# EAGLE design Arduino_MEGA_2560-Rev3 (EAGLE 7.6.0)
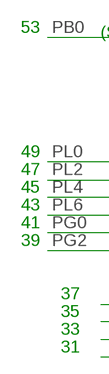
[diagram p0: schematic, sheet 1, part 1 of 2]
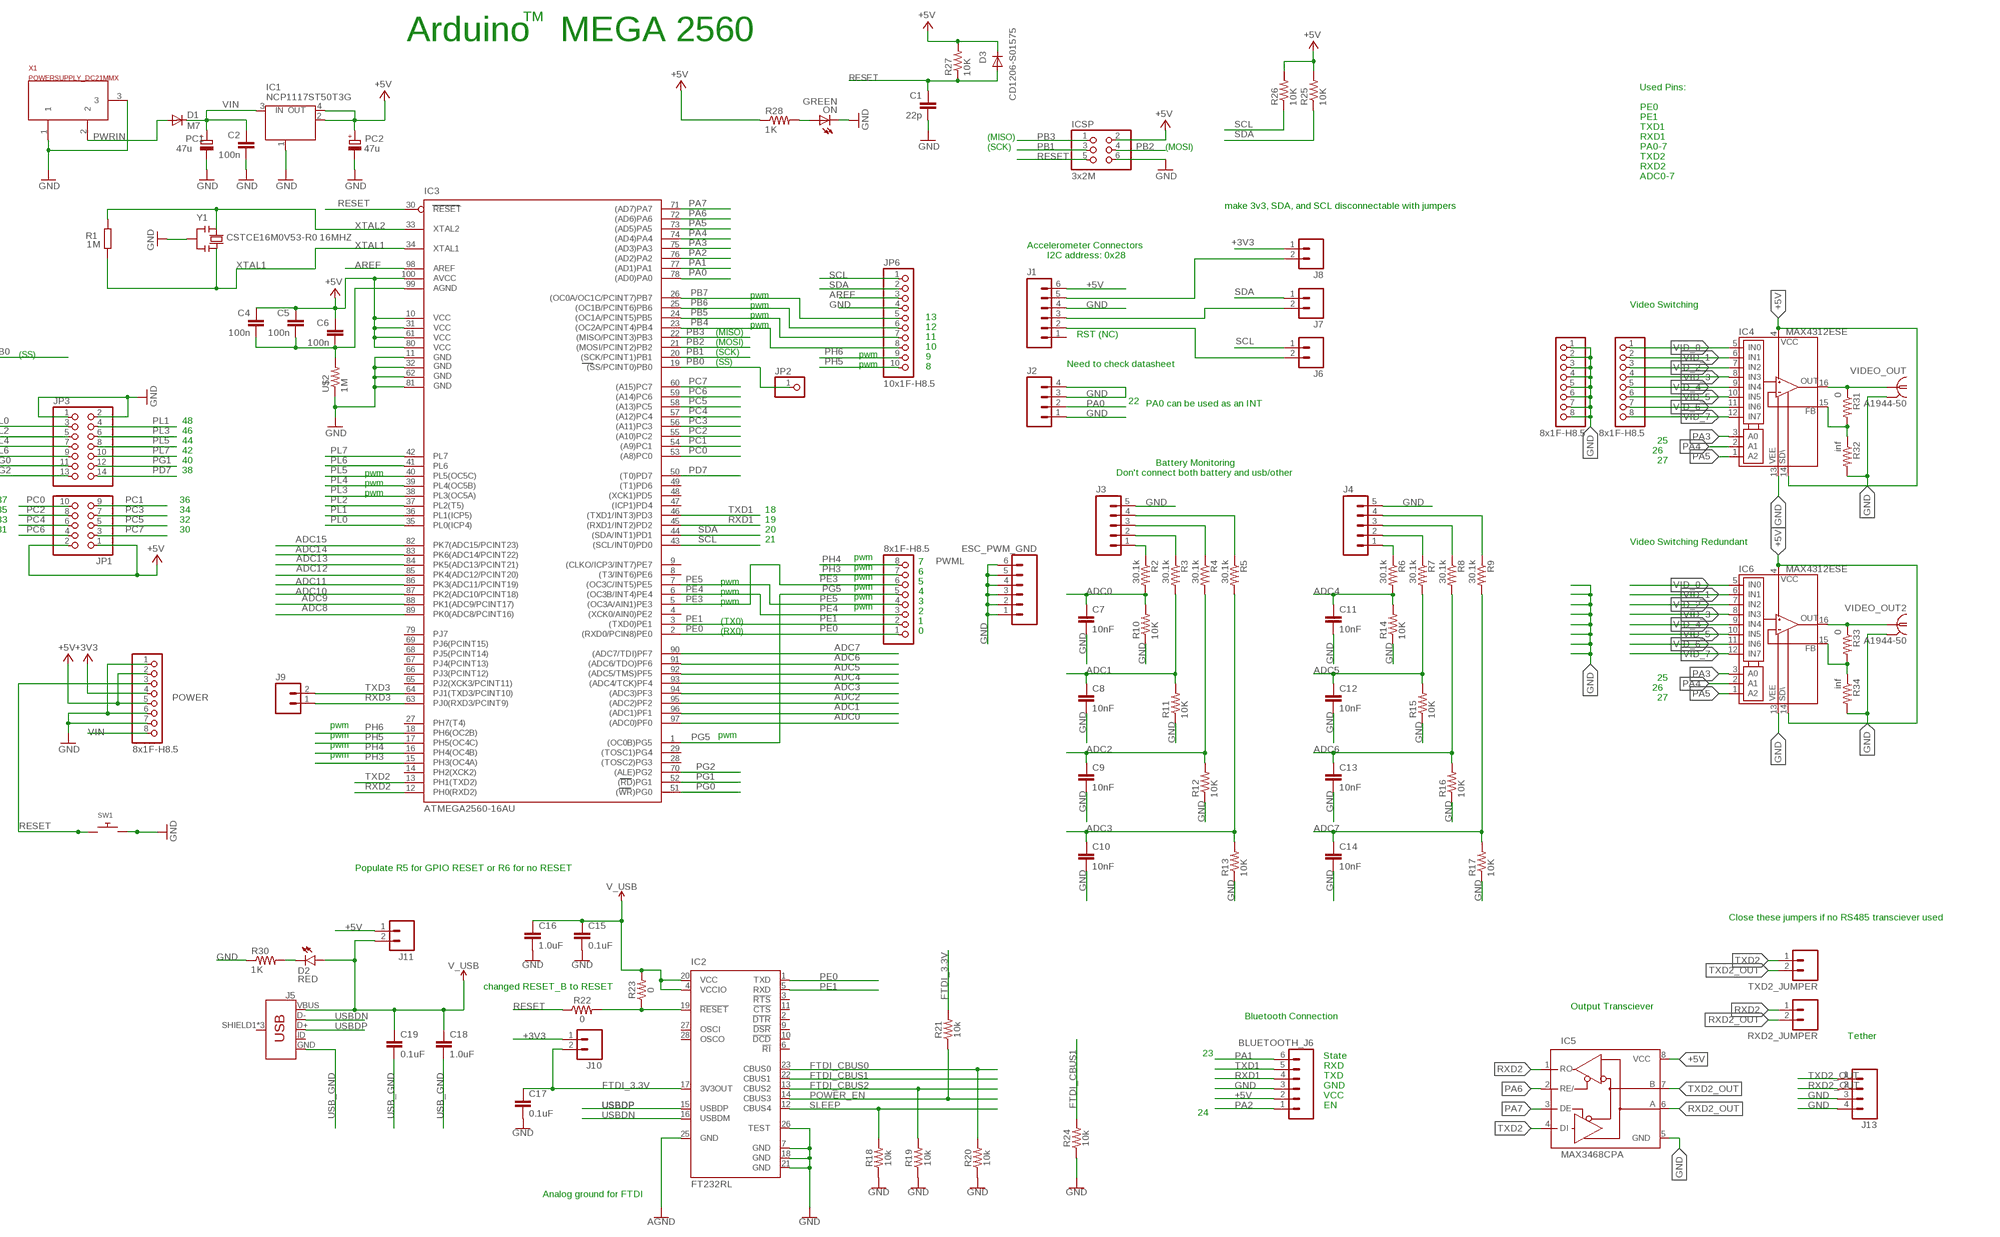
[diagram p1: schematic, sheet 1, part 2 of 2]

## Parts
BLUETOOTH_J6  M06LONGPADS  [1X06_LONGPADS]
C1  22p  C-EU0603-RND  [C0603-ROUND]
C2  100n  C-EU0603-RND  [C0603-ROUND]
C4  100n  C-EU0603-RND  [C0603-ROUND]
C5  100n  C-EU0603-RND  [C0603-ROUND]
C6  100n  C-EU0603-RND  [C0603-ROUND]
C7  10nF  10NF/10000PF-50V-10%(0603)  [0603-CAP]
C8  10nF  10NF/10000PF-50V-10%(0603)  [0603-CAP]
C9  10nF  10NF/10000PF-50V-10%(0603)  [0603-CAP]
C10  10nF  10NF/10000PF-50V-10%(0603)  [0603-CAP]
C11  10nF  10NF/10000PF-50V-10%(0603)  [0603-CAP]
C12  10nF  10NF/10000PF-50V-10%(0603)  [0603-CAP]
C13  10nF  10NF/10000PF-50V-10%(0603)  [0603-CAP]
C14  10nF  10NF/10000PF-50V-10%(0603)  [0603-CAP]
C15  0.1uF  0.1UF-0603-25V-5%  [0603]
C16  1.0uF  1.0UF-0603-16V-10%  [0603]
C17  0.1uF  0.1UF-0603-25V-5%  [0603]
C18  1.0uF  1.0UF-0603-16V-10%  [0603]
C19  0.1uF  0.1UF-0603-25V-5%  [0603]
D1  M7  DIODE-SMB  [SMB]
D2  RED  LED-RED0603  [LED-0603]
D3  CD1206-S01575  DIODE-MINIMELF  [MINIMELF]
ESC_PWM_GND  M06LONGPADS  [1X06_LONGPADS]
IC1  NCP1117ST50T3G  MC33269ST-3.3T3  [SOT223]
IC2  FT232RL  [SSOP28]
IC3  ATMEGA2560-16AU  ATMEGA25602560-16AU  [TQFP100]
IC4  MAX4312ESE  [SO16]
IC5  MAX3468CPA  [DIL08]
IC6  MAX4312ESE  [SO16]
ICSP  3x2M  PINHD-2X3  [2X03]
J1  M06LONGPADS  [1X06_LONGPADS]
J2  M04LONGPADS  [1X04_LONGPADS]
J3  M05JST-VERT  [JST-5-PTH-VERT]
J4  M05JST-VERT  [JST-5-PTH-VERT]
J5  USB_MICRO-B_FEMALE-SMT  [USB-B-MICRO-SMD]
J6  M02PTH  [1X02]
J7  M02PTH  [1X02]
J8  M02PTH  [1X02]
J9  M02PTH  [1X02]
J10  M02PTH  [1X02]
J11  M02PTH  [1X02]
J13  M04LONGPADS  [1X04_LONGPADS]
JP1  PINHD-2X5  [2X05]
JP2  PINHD-1X1  [1X01]
JP3  PINHD-2X7  [2X07]
JP6  10x1F-H8.5  PINHD-1X10_ARD  [1X10]
ON  GREEN  LEDCHIP-LED0805  [CHIP-LED0805]
PC1  47u  CPOL-EUD  [PANASONIC_D]
PC2  47u  CPOL-EUD  [PANASONIC_D]
POWER  8x1F-H8.5  PINHD-1X8  [1X08]
PWML  8x1F-H8.5  PINHD-1X8  [1X08]
R1  1M  R-EU_R0603  [R0603-ROUND]
R2  30.1k  30.1KOHM1/10W1%(0603)  [0603-RES]
R3  30.1k  30.1KOHM1/10W1%(0603)  [0603-RES]
R4  30.1k  30.1KOHM1/10W1%(0603)  [0603-RES]
R5  30.1k  30.1KOHM1/10W1%(0603)  [0603-RES]
R6  30.1k  30.1KOHM1/10W1%(0603)  [0603-RES]
R7  30.1k  30.1KOHM1/10W1%(0603)  [0603-RES]
R8  30.1k  30.1KOHM1/10W1%(0603)  [0603-RES]
R9  30.1k  30.1KOHM1/10W1%(0603)  [0603-RES]
R10  10K  10KOHM-1/10W-1%(0603)0603  [0603-RES]
R11  10K  10KOHM-1/10W-1%(0603)0603  [0603-RES]
R12  10K  10KOHM-1/10W-1%(0603)0603  [0603-RES]
R13  10K  10KOHM-1/10W-1%(0603)0603  [0603-RES]
R14  10K  10KOHM-1/10W-1%(0603)0603  [0603-RES]
R15  10K  10KOHM-1/10W-1%(0603)0603  [0603-RES]
R16  10K  10KOHM-1/10W-1%(0603)0603  [0603-RES]
R17  10K  10KOHM-1/10W-1%(0603)0603  [0603-RES]
R18  10k  10KOHM-0603-1/10W-1%  [0603]
R19  10k  10KOHM-0603-1/10W-1%  [0603]
R20  10k  10KOHM-0603-1/10W-1%  [0603]
R21  10k  10KOHM-0603-1/10W-1%  [0603]
R22  0  0OHM-0603-1/10W-5%  [0603]
R23  0  0OHM-0603-1/10W-5%  [0603]
R24  10k  10KOHM-0603-1/10W-1%  [0603]
R25  10K  10KOHM-1/10W-1%(0603)0603  [0603-RES]
R26  10K  10KOHM-1/10W-1%(0603)0603  [0603-RES]
R27  10K  10KOHM-1/10W-1%(0603)0603  [0603-RES]
R28  1K  1KOHM-1/10W-1%(0603)  [0603-RES]
R30  1K  1KOHM-1/10W-1%(0603)  [0603-RES]
R31  0  30.1KOHM1/10W1%(0603)  [0603-RES]
R32  inf  30.1KOHM1/10W1%(0603)  [0603-RES]
R33  0  30.1KOHM1/10W1%(0603)  [0603-RES]
R34  inf  30.1KOHM1/10W1%(0603)  [0603-RES]
RXD2_JUMPER  M02PTH  [1X02]
SW1  SWITCH_PUSHBUTTONC&K_KSS  [BTN_CK_KSS]
TXD2_JUMPER  M02PTH  [1X02]
U$2  1M  820KOHM-1/10W-1%(0603)  [0603-RES]
VIDEO_IN  8x1F-H8.5  PINHD-1X8  [1X08]
VIDEO_IN_GND  8x1F-H8.5  PINHD-1X8  [1X08]
VIDEO_OUT  A1944-50  [A1944]
VIDEO_OUT2  A1944-50  [A1944]
X1  POWERSUPPLY_DC21MMX  [POWERSUPPLY_DC-21MM]
Y1  CSTCE16M0V53-R0 16MHZ  RESONATORMU  [RESONATOR]

## Nets
+3V3 [power]: J8.1 J10.1 POWER.4
+5V [power usb]: BLUETOOTH_J6.2 C4.1 C5.1 C6.1 D3.C IC1.2(OUT) IC1.4(OUT) IC3.10(VCC) IC3.31(VCC1) IC3.61(VCC2) IC3.80(VCC3) IC3.100(AVCC) IC4.4(V+) IC4.14(!SHDN) IC5.8(VCC) IC6.4(V+) IC6.14(!SHDN) ICSP.2 J1.6 J11.1 JP1.1 JP1.2 PC2.+ POWER.2 POWER.5 R25.2 R26.2 R27.2 R28.1
ADC0: C7.1 IC3.97((ADC0)PF0) R2.2 R10.2
ADC1: C8.1 IC3.96((ADC1)PF1) R3.2 R11.2
ADC2: C9.1 IC3.95((ADC2)PF2) R4.2 R12.2
ADC3: C10.1 IC3.94((ADC3)PF3) R5.2 R13.2
ADC4: C11.1 IC3.93((ADC4/TCK)PF4) R6.2 R14.2
ADC5: C12.1 IC3.92((ADC5/TMS)PF5) R7.2 R15.2
ADC6: C13.1 IC3.91((ADC6/TDO)PF6) R8.2 R16.2
ADC7: C14.1 IC3.90((ADC7/TDI)PF7) R9.2 R17.2
ADC8: IC3.89(PK0(ADC8/PCINT16))
ADC9: IC3.88(PK1(ADC9/PCINT17))
ADC10: IC3.87(PK2(ADC10/PCINT18))
ADC11: IC3.86(PK3(ADC11/PCINT19))
ADC12: IC3.85(PK4(ADC12/PCINT20))
ADC13: IC3.84(PK5(ADC13/PCINT21))
ADC14: IC3.83(PK6(ADC14/PCINT22))
ADC15: IC3.82(PK7(ADC15/PCINT23))
AGND: C4.2 C5.2 C6.2 IC2.25(GND) IC3.99(AGND) U$2.2
AREF: IC3.98(AREF) JP6.3
FTDI_3.3V: C17.1 IC2.17(3V3OUT) J10.2 R21.2
FTDI_CBUS0: IC2.23(CBUS0) R20.2
FTDI_CBUS1: IC2.22(CBUS1) R24.2
FTDI_CBUS2: IC2.13(CBUS2) R19.2
GND [gnd]: BLUETOOTH_J6.3 C1.2 C2.2 C7.2 C8.2 C9.2 C10.2 C11.2 C12.2 C13.2 C14.2 C15.2 C16.2 C17.2 ESC_PWM_GND.1 ESC_PWM_GND.2 ESC_PWM_GND.3 ESC_PWM_GND.4 ESC_PWM_GND.5 ESC_PWM_GND.6 IC1.1(GND/ADJ) IC2.7(GND) IC2.18(GND) IC2.21(GND) IC2.26(TEST) IC3.11(GND) IC3.32(GND1) IC3.62(GND2) IC3.81(GND3) IC4.13(V-) IC5.5(GND) IC6.13(V-) ICSP.6 J1.4 J2.1 J2.3 J2.4 J3.5 J4.5 J13.3 J13.4 JP3.1 JP3.2 JP6.4 ON.C PC1.- PC2.- POWER.1 POWER.6 POWER.7 R10.1 R11.1 R12.1 R13.1 R14.1 R15.1 R16.1 R17.1 R18.1 R19.1 R20.1 R24.1 R30.1 R32.2 R34.2 SW1.P$2 U$2.1 VIDEO_IN_GND.1 VIDEO_IN_GND.2 VIDEO_IN_GND.3 VIDEO_IN_GND.4 VIDEO_IN_GND.5 VIDEO_IN_GND.6 VIDEO_IN_GND.7 VIDEO_IN_GND.8 VIDEO_OUT2.2 VIDEO_OUT2.3 VIDEO_OUT2.4 VIDEO_OUT2.5 VIDEO_OUT.2 VIDEO_OUT.3 VIDEO_OUT.4 VIDEO_OUT.5 X1.1 X1.3 Y1.2
N$1: J3.1 R2.1
N$3: ON.A R28.2
N$4: IC2.19(!RESET) R22.2 R23.1
N$5: J4.1 R6.1
N$6: J3.2 R3.1
N$7: J1.5 J8.2
N$8: J3.3 R4.1
N$9: J1.3 J7.2
N$10: J3.4 R5.1
N$11: J1.2 J6.2
N$12: J4.2 R7.1
N$13: J4.3 R8.1
N$14: J4.4 R9.1
N$15: D2.C R30.2
N$17: IC4.15(FB) R31.2 R32.1
N$18: IC6.15(FB) R33.2 R34.1
PA0: IC3.78((AD0)PA0) J2.2
PA1: BLUETOOTH_J6.6 IC3.77((AD1)PA1)
PA2: BLUETOOTH_J6.1 IC3.76((AD2)PA2)
PA3: IC3.75((AD3)PA3) IC4.3(A0) IC6.3(A0)
PA4: IC3.74((AD4)PA4) IC4.2(A1) IC6.2(A1)
PA5: IC3.73((AD5)PA5) IC4.1(A2) IC6.1(A2)
PA6: IC3.72((AD6)PA6) IC5.2(RE/)
PA7: IC3.71((AD7)PA7) IC5.3(DE)
PB0: IC3.19((SS/PCINT0)PB0) JP2.1
PB1: IC3.20((SCK/PCINT1)PB1) ICSP.3
PB2: IC3.21((MOSI/PCINT2)PB2) ICSP.4
PB3: IC3.22((MISO/PCINT3)PB3) ICSP.1
PB4: IC3.23((OC2A/PCINT4)PB4) JP6.8
PB5: IC3.24((OC1A/PCINT5)PB5) JP6.7
PB6: IC3.25((OC1B/PCINT6)PB6) JP6.6
PB7: IC3.26((OC0A/OC1C/PCINT7)PB7) JP6.5
PC0: IC3.53((A8)PC0) JP1.10
PC1: IC3.54((A9)PC1) JP1.9
PC2: IC3.55((A10)PC2) JP1.8
PC3: IC3.56((A11)PC3) JP1.7
PC4: IC3.57((A12)PC4) JP1.6
PC5: IC3.58((A13)PC5) JP1.5
PC6: IC3.59((A14)PC6) JP1.4
PC7: IC3.60((A15)PC7) JP1.3
PD7: IC3.50((T0)PD7) JP3.14
PE0: IC2.1(TXD) IC3.2((RXD0/PCIN8)PE0) PWML.1
PE1: IC2.5(RXD) IC3.3((TXD0)PE1) PWML.2
PE3: IC3.5((OC3A/AIN1)PE3) PWML.6
PE4: IC3.6((OC3B/INT4)PE4) PWML.3
PE5: IC3.7((OC3C/INT5)PE5) PWML.4
PG0: IC3.51((WR)PG0) JP3.11
PG1: IC3.52((RD)PG1) JP3.12
PG2: IC3.70((ALE)PG2) JP3.13
PG5: IC3.1((OC0B)PG5) PWML.5
PH3: IC3.15(PH3(OC4A)) PWML.7
PH4: IC3.16(PH4(OC4B)) PWML.8
PH5: IC3.17(PH5(OC4C)) JP6.10
PH6: IC3.18(PH6(OC2B)) JP6.9
PL0: IC3.35(PL0(ICP4)) JP3.3
PL1: IC3.36(PL1(ICP5)) JP3.4
PL2: IC3.37(PL2(T5)) JP3.5
PL3: IC3.38(PL3(OC5A)) JP3.6
PL4: IC3.39(PL4(OC5B)) JP3.7
PL5: IC3.40(PL5(OC5C)) JP3.8
PL6: IC3.41(PL6) JP3.9
PL7: IC3.42(PL7) JP3.10
POWER_EN: IC2.14(CBUS3) R21.1
PWRIN [power]: D1.A X1.2
RESET: C1.1 D3.A IC3.30(RESET) ICSP.5 POWER.3 R22.1 R27.1 SW1.P$1
RXD1: BLUETOOTH_J6.4 IC3.45((RXD1/INT2)PD2)
RXD2: IC3.12(PH0(RXD2)) IC5.1(RO) RXD2_JUMPER.1
RXD2_OUT: IC5.6(A) J13.2 RXD2_JUMPER.2
RXD3: IC3.63(PJ0(RXD3/PCINT9)) J9.1
SCL: IC3.43((SCL/INT0)PD0) J6.1 JP6.1 R26.1
SDA: IC3.44((SDA/INT1)PD1) J7.1 JP6.2 R25.1
SLEEP: IC2.12(CBUS4) R18.2
TXD1: BLUETOOTH_J6.5 IC3.46((TXD1/INT3)PD3)
TXD2: IC3.13(PH1(TXD2)) IC5.4(DI) TXD2_JUMPER.1
TXD2_OUT: IC5.7(B) J13.1 TXD2_JUMPER.2
TXD3: IC3.64(PJ1(TXD3/PCINT10)) J9.2
USB_GND: C18.2 C19.2 J5.GND
USBDN: IC2.16(USBDM) J5.D-
USBDP: IC2.15(USBDP) J5.D+
V_USB: C15.1 C16.1 C18.1 C19.1 D2.A IC2.4(VCCIO) IC2.20(VCC) J5.VBUS J11.2 R23.2
VID_0: IC4.5(IN0) IC6.5(IN0) VIDEO_IN.1
VID_1: IC4.6(IN1) IC6.6(IN1) VIDEO_IN.2
VID_2: IC4.7(IN2) IC6.7(IN2) VIDEO_IN.3
VID_3: IC4.8(IN3) IC6.8(IN3) VIDEO_IN.4
VID_4: IC4.9(IN4) IC6.9(IN4) VIDEO_IN.5
VID_5: IC4.10(IN5) IC6.10(IN5) VIDEO_IN.6
VID_6: IC4.11(IN6) IC6.11(IN6) VIDEO_IN.7
VID_7: IC4.12(IN7) IC6.12(IN7) VIDEO_IN.8
VIDEO_OUT: IC4.16(OUT) R31.1 VIDEO_OUT.1
VIDEO_OUT1: IC6.16(OUT) R33.1 VIDEO_OUT2.1
VIN [power]: C2.1 D1.C IC1.3(IN) PC1.+ POWER.8
XTAL1: IC3.34(XTAL1) R1.1 Y1.3
XTAL2: IC3.33(XTAL2) R1.2 Y1.1
Unconnected: IC2.2(!DTR) IC2.3(!RTS) IC2.6(!RI) IC2.9(!DSR) IC2.10(!DCD) IC2.11(!CTS) IC2.27(OSCI) IC2.28(OSCO) IC3.4((XCK0/AIN0)PE2) IC3.8((T3/INT6)PE6) IC3.9((CLKO/ICP3/INT7)PE7) IC3.14(PH2(XCK2)) IC3.27(PH7(T4)) IC3.28((TOSC2)PG3) IC3.29((TOSC1)PG4) IC3.47((ICP1)PD4) IC3.48((XCK1)PD5) IC3.49((T1)PD6) IC3.65(PJ2(XCK3/PCINT11)) IC3.66(PJ3(PCINT12)) IC3.67(PJ4(PCINT13)) IC3.68(PJ5(PCINT14)) IC3.69(PJ6(PCINT15)) IC3.79(PJ7) J1.1 J5.ID J5.SHIELD1(SHIELD) J5.SHIELD2(SHIELD) J5.SHIELD3(SHIELD)

## Notes on the sheet
- TM
- Arduino   MEGA 2560
- Used Pins:
- PE0
- PE1
- TXD1
- (MISO) | RXD1
- (SCK) | (MOSI) | PA0-7
- TXD2
- RXD2
- ADC0-7
- make 3v3, SDA, and SCL disconnectable with jumpers
- Accelerometer Connectors
- I2C address: 0x28
- pwm
- pwm | Video Switching
- pwm | 13
- pwm | 12
- (MISO) | RST (NC)
- 11
- (MOSI)
- 10
- 53 | (SS) | (SCK) | pwm
- 9
- (SS) | pwm | Need to check datasheet
- 8
- 22 | PA0 can be used as an INT
- 49 | 48
- 47 | 46
- 45 | 44 | 25
- 43 | 42 | 26
- 41 | 40 | Battery Monitoring | 27
- 39 | 38 | pwm | Don't connect both battery and usb/other
- pwm
- pwm
- 37 | 36
- 35 | 34 | 18
- 33 | 32 | 19
- 31 | 30 | 20
- 21 | Video Switching Redundant
- pwm
- 7
- pwm
- 6
- pwm
- pwm | 5
- pwm
- pwm | 4
- pwm
- pwm | 3
- pwm
- 2
- (TX0) | 1
- (RX0) | 0
- 25
- 26
- 27
- pwm
- pwm | pwm
- pwm
- pwm
- Populate R5 for GPIO RESET or R6 for no RESET
- Close these jumpers if no RS485 transciever used
- changed RESET_B to RESET
- Output Transciever
- Bluetooth Connection
- Tether
- 23 | State
- RXD
- TXD
- GND
- VCC
- EN
- 24
- Analog ground for FTDI

## Library data of the parts
BLUETOOTH_J6 ESC_PWM_GND J1 = SparkFun-Connectors:M06: Header 6 Standard 6-pin 0.1" header. Use with straight break away headers (SKU : PRT-00116), right angle break away headers (PRT-00553), swiss pins (PRT-00743), machine pins (PRT-00117), and female headers (PRT-00115). Molex polarized connector foot print use with SKU : PRT-08094 with associated crimp pins and housings. NOTES ON THE VARIANTS LOCK and LOCK_LONGPADS... This footprint was designed to help hold the alignment of a through-hole component (i.e. 6-pin header) while soldering it into place. You may notice that each hole has been shifted either up or down by 0.005 of an inch from it's more standard position (which is a perfectly straight line). This slight alteration caused the pins (the squares in the middle) to touch the edges of the holes. Because they are alternating, it causes a "brace" to hold the component in place. 0.005 has proven to be the perfect amount of "off-center" position when using our standard breakaway headers. Although looks a little odd when you look at the bare footprint, once you have a header in there, the alteration is very hard to notice. Also,if you push a header all the way into place, it is covered up entirely on the bottom side. This idea of altering the position of holes to aid alignment will be further integrated into the Sparkfun Library for other footprints. It can help hold any component with 3 or more connection pins.
C1 C2 C4-C6 = SmartPrj:C-EU: CAPACITOR, European symbol
C7-C14 = SparkFun-Capacitors:10NF/10000PF-50V-10%(0603): CAP-00867; PROD_ID: CAP-00867
C15 C17 C19 = SparkFun-Capacitors:0.1UF: 0.1µF ceramic capacitors A capacitor is a passive two-terminal electrical component used to store electrical energy temporarily in an electric field.; PROD_ID: CAP-08604
C16 C18 = SparkFun-Capacitors:1.0UF: 1µF ceramic capacitors A capacitor is a passive two-terminal electrical component used to store electrical energy temporarily in an electric field.; PROD_ID: CAP-00868
D1 D3 = diode:DIODE-: DIODE
D2 = SparkFun-LED:LED-RED: Assorted Red LEDs LilyPad 1206- DIO-09912 1206- DIO-00809 0603- DIO-00819 "SMART" means more efficient and expensive; PROD_ID: DIO-00819
IC1 = linear:MC33269ST*: Adjustable Output Low Dropout Voltage Regulator 800 mA Source: http://www.onsemi.com/pub/Collateral/MC33269-D.PDF
IC2 = ftdichip:FT232R: Source: http://www.ftdichip.com/Documents/DataSheets/DS_FT232R_v104.pdf; MPN: FT232RL; OC_FARNELL: 1146032; OC_NEWARK: 91K9918
IC3 = SmartPrj:ATMEGA2560: MICROCONTROLLER 64/128/256 Kbytes FLASH 4 Kbytes EEPROM 8 Kbytes SRAM 86 General Purpose I/O pins 12-channels16-bit PWM 4 x Serial USARTs 16-channels 10-bit A/D
IC4 IC6 = maxim:MAX4312: Video Multiplexer-Amplifier High-Speed, Low-Power, Single-Supply, Multichannel; MPN: MAX4312ESE+; OC_FARNELL: unknown; OC_NEWARK: 53K6837
IC5 = maxim:MAX34*: +5V, Fail-Safe, 40Mbps, Profibus RS-485/RS-422 Transceivers Source: MAX3465-MAX3469.pdf; OC_FARNELL: unknown; OC_NEWARK: unknown
ICSP = SmartPrj:PINHD-2X3: PIN HEADER
J2 J13 = SparkFun-Connectors:M04: Header 4 Standard 4-pin 0.1" header. Use with straight break away headers (SKU : PRT-00116), right angle break away headers (PRT-00553), swiss pins (PRT-00743), machine pins (PRT-00117), and female headers (PRT-00115). Molex polarized connector foot print use with SKU : PRT-08231 with associated crimp pins and housings. 1MM SMD Version SKU: PRT-10208; PROD_ID: CONN-09696
J3 J4 = SparkFun-Connectors:M05: Header 5 Standard 5-pin 0.1" header. Use with straight break away headers (SKU : PRT-00116), right angle break away headers (PRT-00553), swiss pins (PRT-00743), machine pins (PRT-00117), and female headers (PRT-00115). Molex polarized connector foot print use with SKU : PRT-08230 with associated crimp pins and housings.
J5 = SparkFun-Connectors:USB_MICRO-B: USB Type Micro-B Connector Male/female and PTH/SMT variants SparkFun Products: SparkFun microB USB Breakout <https://www.sparkfun.com/products/12035> SparkFun USB microB Plug Breakout <https://www.sparkfun.com/products/10031> SparkFun ESP8266 Thing <https://www.sparkfun.com/products/13231>; PROD_ID: CONN-11752
J6-J11 RXD2_JUMPER TXD2_JUMPER = SparkFun-Connectors:M02: Standard 2-pin 0.1" header. Use with - straight break away headers ( PRT-00116) - right angle break away headers (PRT-00553) - swiss pins (PRT-00743) - machine pins (PRT-00117) - female headers (PRT-00115) Molex polarized connector foot print use with: PRT-08233 with associated crimp pins and housings. 2.54_SCREWTERM for use with PRT-10571. 3.5mm Screw Terminal footprints for PRT-08084 5mm Screw Terminal footprints for use with PRT-08432
JP1 = pinhead:PINHD-2X5: PIN HEADER
JP2 = pinhead:PINHD-1X1: PIN HEADER
JP3 = pinhead:PINHD-2X7: PIN HEADER
JP6 = SmartPrj:PINHD-1X10_ARD: PIN HEADER
ON = led:LED: LED OSRAM: - CHIPLED LG R971, LG N971, LY N971, LG Q971, LY Q971, LO R971, LY R971 LH N974, LH R974 LS Q976, LO Q976, LY Q976 LO Q996 - Hyper CHIPLED LW Q18S LB Q993, LB Q99A, LB R99A - SideLED LS A670, LO A670, LY A670, LG A670, LP A670 LB A673, LV A673, LT A673, LW A673 LH A674 LY A675 LS A676, LA A676, LO A676, LY A676, LW A676 LS A679, LY A679, LG A679 - Hyper Micro SIDELED® LS Y876, LA Y876, LO Y876, LY Y876 LT Y87S - SmartLED LW L88C, LW L88S LB L89C, LB L89S, LG L890 LS L89K, LO L89K, LY L89K LS L896, LA L896, LO L896, LY L896 - TOPLED LS T670, LO T670, LY T670, LG T670, LP T670 LSG T670, LSP T670, LSY T670, LOP T670, LYG T670 LG T671, LOG T671, LSG T671 LB T673, LV T673, LT T673, LW T673 LH T674 LS T676, LA T676, LO T676, LY T676, LB T676, LH T676, LSB T676, LW T676 LB T67C, LV T67C, LT T67C, LS T67K, LO T67K, LY T67K, LW E67C LS E67B, LA E67B, LO E67B, LY E67B, LB E67C, LV E67C, LT E67C LW T67C LS T679, LY T679, LG T679 LS T770, LO T770, LY T770, LG T770, LP T770 LB T773, LV T773, LT T773, LW T773 LH T774 LS E675, LA E675, LY E675, LS T675 LS T776, LA T776, LO T776, LY T776, LB T776 LHGB T686 LT T68C, LB T68C - Hyper Mini TOPLED® LB M676 - Mini TOPLED Santana® LG M470 LS M47K, LO M47K, LY M47K Source: http://www.osram.convergy.de LUXEON: - LUMILED® LXK2-PW12-R00, LXK2-PW12-S00, LXK2-PW14-U00, LXK2-PW14-V00 LXK2-PM12-R00, LXK2-PM12-S00, LXK2-PM14-U00 LXK2-PE12-Q00, LXK2-PE12-R00, LXK2-PE12-S00, LXK2-PE14-T00, LXK2-PE14-U00 LXK2-PB12-K00, LXK2-PB12-L00, LXK2-PB12-M00, LXK2-PB14-N00, LXK2-PB14-P00, LXK2-PB14-Q00 LXK2-PR12-L00, LXK2-PR12-M00, LXK2-PR14-Q00, LXK2-PR14-R00 LXK2-PD12-Q00, LXK2-PD12-R00, LXK2-PD12-S00 LXK2-PH12-R00, LXK2-PH12-S00 LXK2-PL12-P00, LXK2-PL12-Q00, LXK2-PL12-R00 Source: www.luxeon.com KINGBRIGHT: KA-3528ASYC Source: www.kingbright.com
PC1 PC2 = rcl:CPOL-EU: POLARIZED CAPACITOR, European symbol
POWER PWML VIDEO_IN VIDEO_IN_GND = SmartPrj:PINHD-1X8: PIN HEADER
R1 = SmartPrj:R-EU_: RESISTOR, European symbol
R2-R9 = SparkFun-Resistors:30.1KOHM1/10W1%(0603): RES-08595; PROD_ID: RES-08595
R10-R17 R25-R27 = SparkFun-Resistors:10KOHM-1/10W-1%(0603): RES-00824; PROD_ID: RES-00824
R18-R21 R24 = SparkFun-Resistors:10KOHM: 10kΩ resistor A resistor is a passive two-terminal electrical component that implements electrical resistance as a circuit element. Resistors act to reduce current flow, and, at the same time, act to lower voltage levels within circuits. - Wikipedia; PROD_ID: RES-00824
R22 R23 = SparkFun-Resistors:0OHM: 0Ω resistor A resistor is a passive two-terminal electrical component that implements electrical resistance as a circuit element. Resistors act to reduce current flow, and, at the same time, act to lower voltage levels within circuits. - Wikipedia; PROD_ID: RES-08609
R28 R30 = SparkFun-Resistors:1KOHM-1/10W-1%(0603): RES-07856; PROD_ID: RES-07856
R31-R34 = SparkFun-Resistors:30.1KOHM1/10W1%(0603): RES-08595; PROD_ID: RES-08595; VALUE: 30.1k
SW1 = adafruit:SWITCH_PUSHBUTTON: Buttons SOFTTOUCHSMD_SJ - Soft touch temporary push button (Super Junk Akihabara) Compatible with SKPMANE010 [Mouser: 688-SKPMAN] C&K_KSS = Digikey: KSS221GLFS
U$2 = SparkFun-Resistors:820KOHM-1/10W-1%(0603); PROD_ID: RES-13247
VIDEO_OUT VIDEO_OUT2 = con-coax:A1944-50: BNC CONNECTOR 50 Ohm distributor Buerklin 78F2475; OC_FARNELL: unknown; OC_NEWARK: unknown
X1 = SmartPrj:POWERSUPPLY_DC21MM
Y1 = SmartPrj:RESONATOR

## Net classes
1 power: width 0.61 mm, drill 0.406 mm, clearance 0.203 mm
2 gnd: width 0.305 mm, drill 0.406 mm, clearance 0.203 mm
3 power usb: width 0.508 mm, drill 0.406 mm, clearance 0.203 mm

## Board
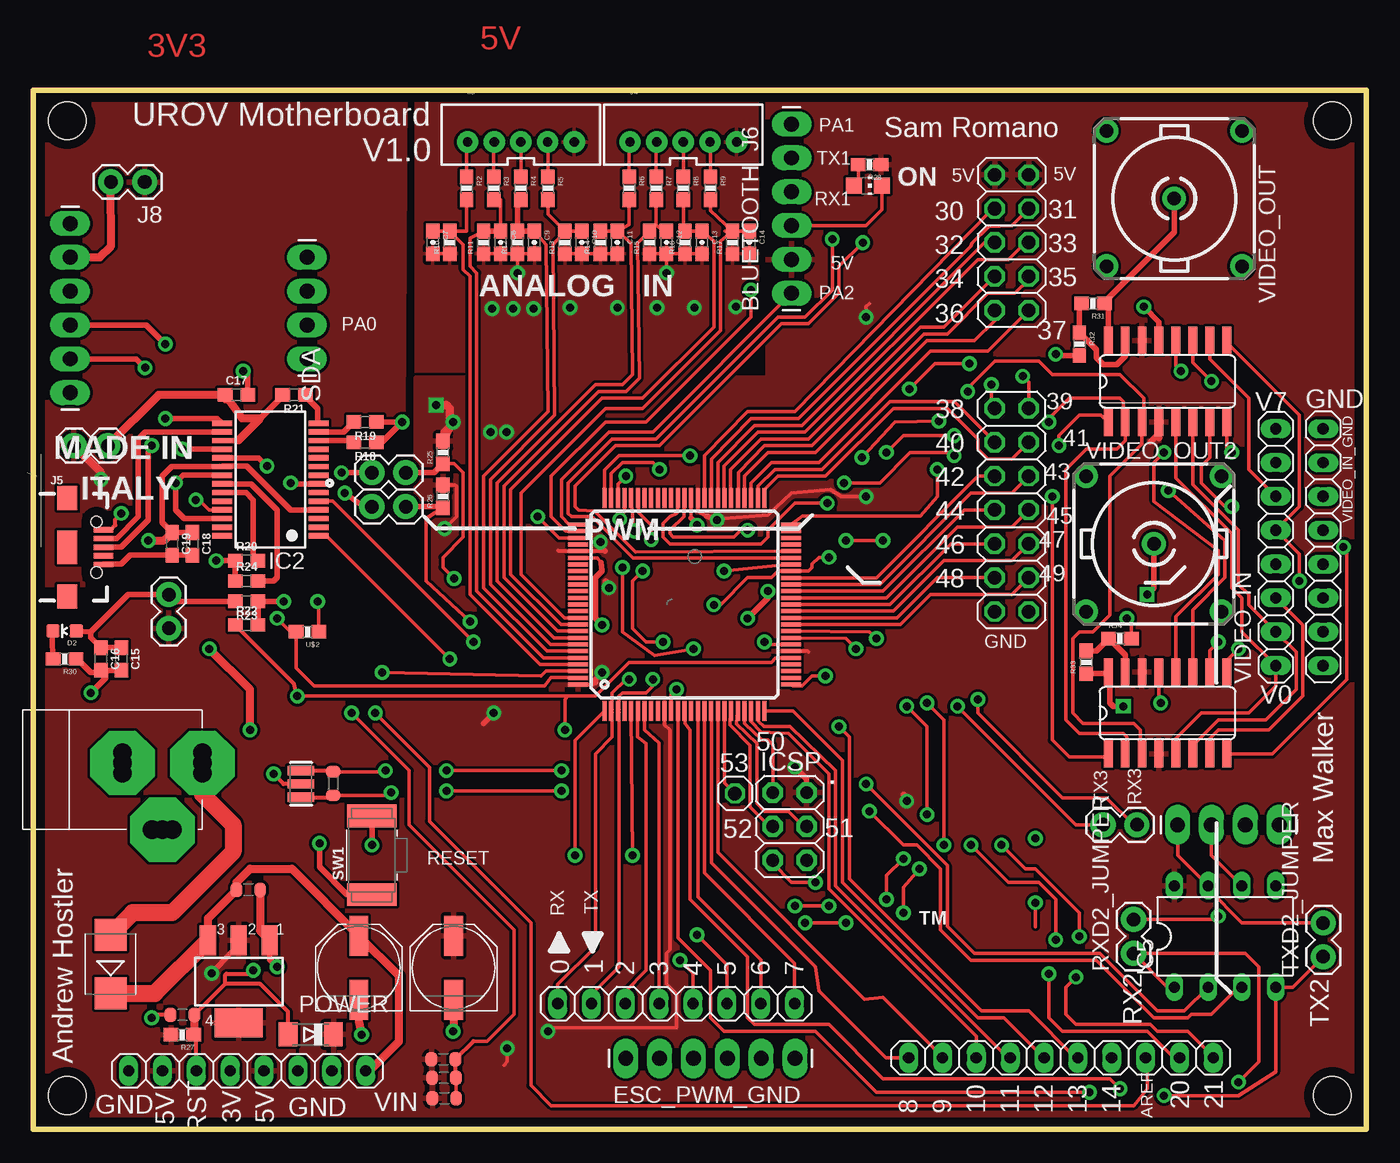
[diagram p2: board, top side]
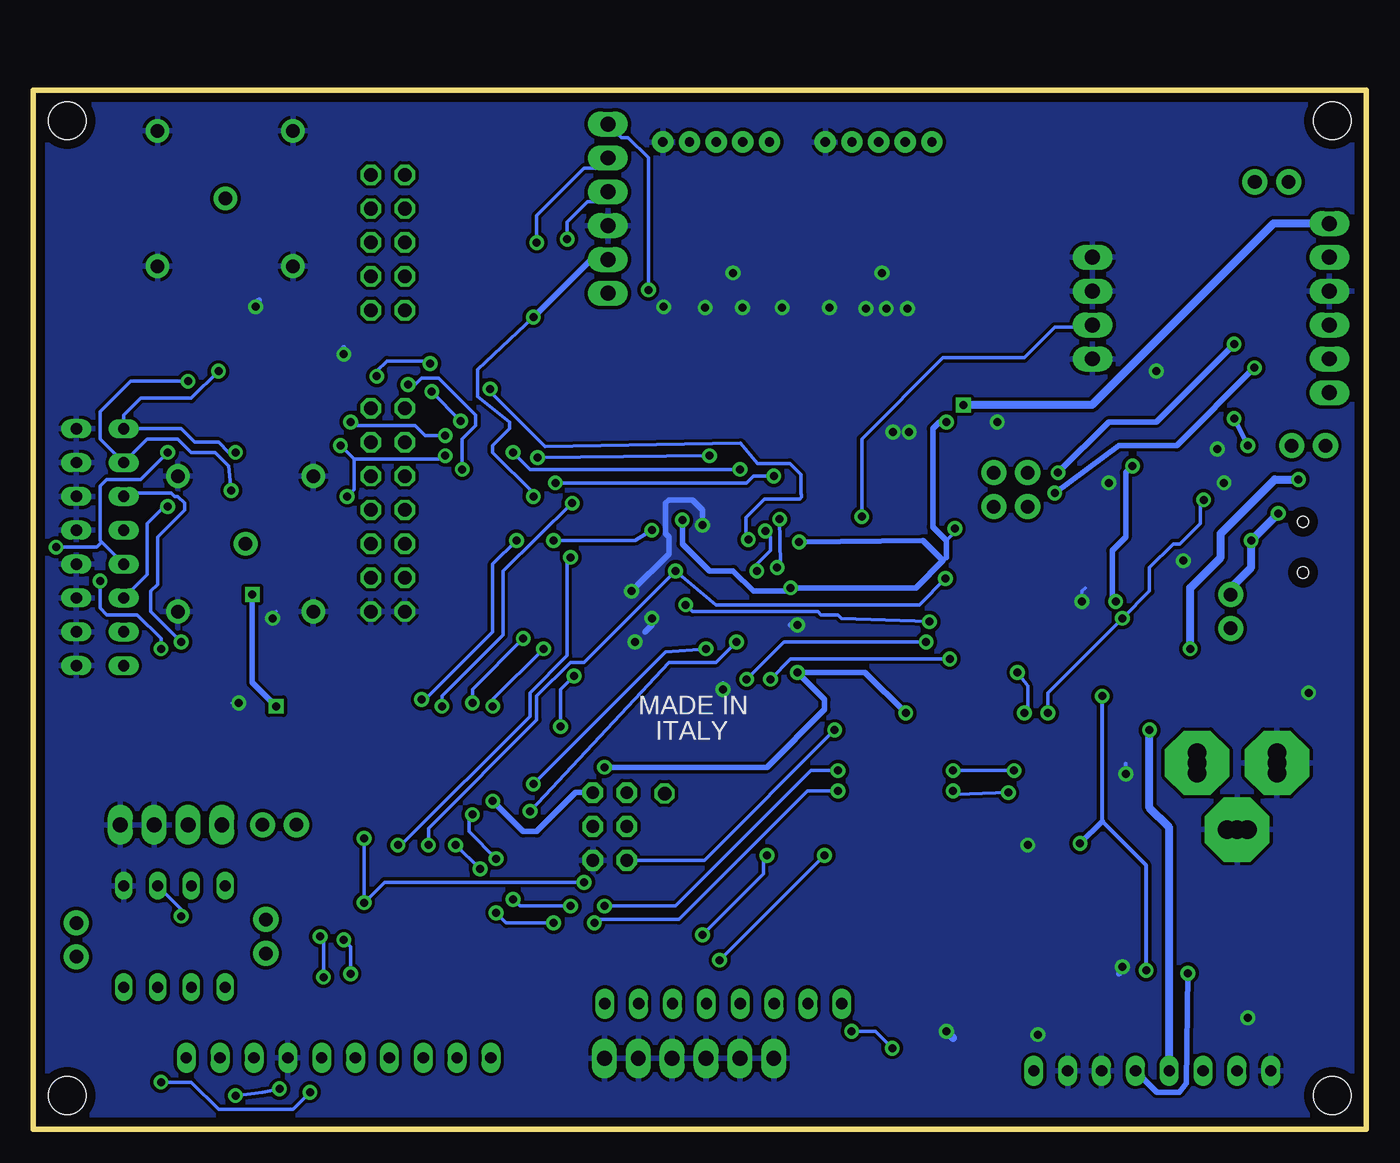
[diagram p3: board, bottom side, seen from below]

Size 100 x 77.98 mm. Coordinates in mm from the lower left corner, seen from the top.
Outline: 100,0 0,0 0,77.98 100,77.98 100,0
Copper layers (1*16): Top 0.035mm / dielectric 1.5mm / Bottom 0.035mm
Design rules "default *": minimum track width 8mil, minimum drill 16mil, track to track 5mil, track to pad 5mil, pad to pad 5mil, via to via 10mil, smd to smd 5mil, copper to edge 27mil, drill to drill 12mil, minimum pad ring 10mil, minimum via ring 10mil, stop-mask expansion 2mil, vias tented up to drill 24mil, thermal gap 10mil
Holes 2.84 mm at 97.46,2.54 97.46,75.69 2.54,75.69 2.54,2.54

### Footprints (pad centres in the part's own frame; a part is rotated, then mirrored left to right if it is on the bottom)
1X06_LONGPADS = drill 1.118 pad 1.88 long: 1 0,0; 2 2.54,0; 3 5.08,0; 4 7.62,0; 5 10.16,0; 6 12.7,0
C0603-ROUND = smd 0.898 x 1.1: 1 -0.889,0; 2 0.889,0
0603-CAP = smd 1.1 x 1: 1 -0.85,0; 2 0.85,0
0603 = smd 1.1 x 1: 1 -0.85,0; 2 0.85,0
SMB = smd 2.4 x 2.4: A 2.2,0; C -2.2,0
LED-0603 = smd 1 x 1: A 0,-0.877; C 0,0.877
MINIMELF = smd 1.4 x 1.8: A 1.7,0; C -1.7,0
SOT223 = smd 1.219 x 2.235: 1 -2.311,-3.099; 2 0,-3.099; 3 2.311,-3.099 | smd 3.6 x 2.2: 4 0,3.099
SSOP28 = smd 0.4 x 1.5: 1 -4.225,-3.625; 2 -3.575,-3.625; 3 -2.925,-3.625; 4 -2.275,-3.625; 5 -1.625,-3.625; 6 -0.975,-3.625; 7 -0.325,-3.625; 8 0.325,-3.625; 9 0.975,-3.625; 10 1.625,-3.625; 11 2.275,-3.625; 12 2.925,-3.625; 13 3.575,-3.625; 14 4.225,-3.625; 15 4.225,3.625; 16 3.575,3.625; 17 2.925,3.625; 18 2.275,3.625; 19 1.625,3.625; 20 0.975,3.625; 21 0.325,3.625; 22 -0.325,3.625; 23 -0.975,3.625; 24 -1.625,3.625; 25 -2.275,3.625; 26 -2.925,3.625; 27 -3.575,3.625; 28 -4.225,3.625
TQFP100 = smd 1.5 x 0.3: 1 -8,6; 2 -8,5.5; 3 -8,5; 4 -8,4.5; 5 -8,4; 6 -8,3.5; 7 -8,3; 8 -8,2.5; 9 -8,2; 10 -8,1.5; 11 -8,1; 12 -8,0.5; 13 -8,0; 14 -8,-0.5; 15 -8,-1; 16 -8,-1.5; 17 -8,-2; 18 -8,-2.5; 19 -8,-3; 20 -8,-3.5; 21 -8,-4; 22 -8,-4.5; 23 -8,-5; 24 -8,-5.5; 25 -8,-6; 51 8,-6; 52 8,-5.5; 53 8,-5; 54 8,-4.5; 55 8,-4; 56 8,-3.5; 57 8,-3; 58 8,-2.5; 59 8,-2; 60 8,-1.5; 61 8,-1; 62 8,-0.5; 63 8,0; 64 8,0.5; 65 8,1; 66 8,1.5; 67 8,2; 68 8,2.5; 69 8,3; 70 8,3.5; 71 8,4; 72 8,4.5; 73 8,5; 74 8,5.5; 75 8,6 | smd 0.3 x 1.5: 26 -6,-8; 27 -5.5,-8; 28 -5,-8; 29 -4.5,-8; 30 -4,-8; 31 -3.5,-8; 32 -3,-8; 33 -2.5,-8; 34 -2,-8; 35 -1.5,-8; 36 -1,-8; 37 -0.5,-8; 38 0,-8; 39 0.5,-8; 40 1,-8; 41 1.5,-8; 42 2,-8; 43 2.5,-8; 44 3,-8; 45 3.5,-8; 46 4,-8; 47 4.5,-8; 48 5,-8; 49 5.5,-8; 50 6,-8; 76 6,8; 77 5.5,8; 78 5,8; 79 4.5,8; 80 4,8; 81 3.5,8; 82 3,8; 83 2.5,8; 84 2,8; 85 1.5,8; 86 1,8; 87 0.5,8; 88 0,8; 89 -0.5,8; 90 -1,8; 91 -1.5,8; 92 -2,8; 93 -2.5,8; 94 -3,8; 95 -3.5,8; 96 -4,8; 97 -4.5,8; 98 -5,8; 99 -5.5,8; 100 -6,8
SO16 = smd 0.66 x 2.032: 1 -4.445,-3.073; 2 -3.175,-3.073; 3 -1.905,-3.073; 4 -0.635,-3.073; 5 0.635,-3.073; 6 1.905,-3.073; 7 3.175,-3.073; 8 4.445,-3.073; 9 4.445,3.073; 10 3.175,3.073; 11 1.905,3.073; 12 0.635,3.073; 13 -0.635,3.073; 14 -1.905,3.073; 15 -3.175,3.073; 16 -4.445,3.073
DIL08 = drill 0.813 long: 1 -3.81,-3.81; 2 -1.27,-3.81; 3 1.27,-3.81; 4 3.81,-3.81; 5 3.81,3.81; 6 1.27,3.81; 7 -1.27,3.81; 8 -3.81,3.81
2X03 = drill 0.95 pad 1.55 octagon: 1 -2.54,-1.27; 2 -2.54,1.27; 3 0,-1.27; 4 0,1.27; 5 2.54,-1.27; 6 2.54,1.27
1X04_LONGPADS = drill 1.118 pad 1.88 long: 1 0,0; 2 2.54,0; 3 5.08,0; 4 7.62,0
JST-5-PTH-VERT = drill 0.7 pad 1.6: 1 -4,0.18; 2 -2,0.18; 3 0,0.18; 4 2,0.18; 5 4,0.18
USB-B-MICRO-SMD = smd 1.45 x 0.4: D+ 2.725,0; D- 2.725,0.65; GND 2.725,-1.3; ID 2.725,-0.65; VBUS 2.725,1.3 | smd 1.5 x 1.8: SHIELD1 0,3.685; SHIELD2 0,-3.685 | smd 1.5 x 2.5: SHIELD3 0,0 | hole 0.85: 2.2,1.9; 2.2,-1.9
1X02 = drill 1.016 pad 1.88: 1 0,0; 2 2.54,0
2X05 = drill 1.016 octagon: 1 -5.08,-1.27; 2 -5.08,1.27; 3 -2.54,-1.27; 4 -2.54,1.27; 5 0,-1.27; 6 0,1.27; 7 2.54,-1.27; 8 2.54,1.27; 9 5.08,-1.27; 10 5.08,1.27
1X01 = drill 1.016 octagon: 1 0,0
2X07 = drill 1.016 octagon: 1 -7.62,-1.27; 2 -7.62,1.27; 3 -5.08,-1.27; 4 -5.08,1.27; 5 -2.54,-1.27; 6 -2.54,1.27; 7 0,-1.27; 8 0,1.27; 9 2.54,-1.27; 10 2.54,1.27; 11 5.08,-1.27; 12 5.08,1.27; 13 7.62,-1.27; 14 7.62,1.27
1X10 = drill 0.85 pad 1.422 long: 1 -11.43,0; 2 -8.89,0; 3 -6.35,0; 4 -3.81,0; 5 -1.27,0; 6 1.27,0; 7 3.81,0; 8 6.35,0; 9 8.89,0; 10 11.43,0
CHIP-LED0805 = smd 1.2 x 1.2: A 0,-1.05; C 0,1.05
PANASONIC_D = smd 3 x 1.4: + 2.4,0; - -2.4,0
1X08 = drill 0.85 pad 1.422 long: 1 -8.89,0; 2 -6.35,0; 3 -3.81,0; 4 -1.27,0; 5 1.27,0; 6 3.81,0; 7 6.35,0; 8 8.89,0
R0603-ROUND = smd 0.898 x 1.1: 1 -0.889,0; 2 0.889,0
0603-RES = smd 1.1 x 1: 1 -0.85,0; 2 0.85,0
BTN_CK_KSS = smd 1.7 x 3.7: P$1 -2.95,0; P$2 2.95,0
A1944 = drill 1.016 pad 1.778: 1 0,0; 2 5.08,5.08; 3 -5.08,5.08; 4 -5.08,-5.08; 5 5.08,-5.08
POWERSUPPLY_DC-21MM = drill 1.4 pad 4.826 octagon: 1 -5.08,-3.353; 2 -0.076,-6.35; 3 -0.076,-0.356 | drill 1.4: 4 -5.08,-4.115; 5 -5.08,-2.591; 6 -0.838,-0.356; 7 0.686,-0.356; 8 -0.838,-6.35; 9 0.686,-6.35
RESONATOR = smd 0.7 x 2: 1 -1,0; 2 0,0; 3 1,0

### Placement (x,y rotation side)
BLUETOOTH_J6  56.9,62.74 90 top
C1  11.19,8.6 180 top
C2  16.13,17.98 0 top
C4  30.77,5.25 0 top
C5  30.83,2.33 0 top
C6  30.8,3.87 0 top
C7  29.97,66.55 270 top
C8  35.05,66.55 270 top
C9  37.59,66.55 270 top
C10  41.15,66.55 270 top
C11  43.81,66.55 270 top
C12  47.5,66.55 270 top
C13  50.16,66.55 270 top
C14  53.72,66.55 270 top
C15  6.6,35.31 270 top
C16  5.08,35.31 270 top
C17  15.24,55.12 0 top
C18  11.94,43.94 270 top
C19  10.41,43.94 270 top
D1  5.79,12.41 90 top
D2  2.35,37.4 90 top
D3  20.81,7.13 180 top
ESC_PWM_GND  44.45,5.33 0 top
IC1  15.41,11.1 180 top
IC2  17.78,48.77 90 top
IC3  48.86,39.39 90 top
IC4  85.09,56.13 0 top
IC5  89.41,14.48 0 top
IC6  85.09,31.24 0 top
ICSP  56.75,22.73 270 top
J1  2.76,55.28 90 top
J2  20.54,57.82 90 top
J3  36.58,73.91 0 top
J4  48.77,73.91 0 top
J5  2.54,43.69 0 top
J6  27.94,46.74 180 top
J7  27.94,49.28 180 top
J8  8.36,71.09 180 top
J9  82.8,22.86 180 top
J10  3.05,51.31 0 top
J11  10.16,37.59 90 top
J13  85.85,22.86 0 top
JP1  73.41,66.55 270 top
JP2  52.64,25.21 0 top
JP3  73.41,46.48 90 top
JP6  77.1,5.38 180 top
ON  62.63,70.8 270 top
PC1  24.41,12.14 90 top
PC2  31.53,12.14 90 top
POWER  16.04,4.4 0 top
PWML  48.23,9.44 0 top
R1  22.5,25.95 90 top
R2  32.51,70.61 270 top
R3  34.54,70.61 270 top
R4  36.58,70.61 270 top
R5  38.61,70.61 270 top
R6  44.7,70.61 270 top
R7  46.74,70.61 270 top
R8  48.77,70.61 270 top
R9  50.8,70.61 270 top
R10  31.24,66.55 90 top
R11  33.78,66.55 90 top
R12  36.32,66.55 90 top
R13  39.88,66.55 90 top
R14  42.55,66.55 90 top
R15  46.23,66.55 90 top
R16  48.9,66.55 90 top
R17  52.45,66.55 90 top
R18  24.89,51.56 180 top
R19  24.89,53.09 180 top
R20  16,42.67 0 top
R21  19.56,55.12 180 top
R22  16,37.85 0 top
R23  16,39.62 180 top
R24  16,41.15 0 top
R25  30.73,50.8 90 top
R26  30.73,47.5 90 top
R27  11.18,7.11 180 top
R28  62.74,72.39 180 top
R30  2.35,35.31 180 top
R31  79.5,61.98 180 top
R32  78.49,58.93 270 top
R33  78.99,35.05 90 top
R34  81.53,36.83 0 top
RXD2_JUMPER  82.55,13.21 90 top
SW1  25.4,20.57 90 top
TXD2_JUMPER  96.77,12.95 90 top
U$2  20.57,37.34 180 top
VIDEO_IN  93.22,43.69 90 top
VIDEO_IN_GND  96.77,43.69 270 top
VIDEO_OUT  85.6,69.85 270 top
VIDEO_OUT2  84.07,43.94 0 top
X1  6.33,27.58 90 top
Y1  20.08,25.92 270 top

### Tracks (layer width: path | path; a pad name or v marks a point on that pad's centre or on a via)
+3V3  (via drill 0.6)
  Top 0.61: v16.26,29.97 16.26,33.02 v13.21,36.07 | v5.08,48.77 5.08,49.28 J10.1
  Bottom 0.61: POWER.4 14.77,22.65 16.26,24.13 v16.26,29.97 | v13.21,36.07 13.21,40.64 10.92,42.93 10.92,44.7 6.86,48.77 v5.08,48.77
  pour Top: -0.51,78.23 27.88,78.23 27.69,40.89 -0.51,40.89
+5V  (via drill 0.6)
  Top 0.254: 39.37,43.43 39.41,43.39 IC3.80 42.89,43.39 | 42.16,33.53 42.03,33.39 IC3.100 | IC3.31 58.09,35.89 58.17,35.81 | IC3.61 49.86,46.4 49.92,46.34 50.5,46.02 51.31,45.78 55.12,46.1 56.9,47.75 59.82,48.01 60.64,47.5 v62.48,47.5 | v62.48,60.96 62.48,61.72 62.74,61.98 | R26.2 31.66,48.35 31.75,48.26 31.75,45.97 v30.86,45.09 30.61,45.09 | v38.61,7.37 38.86,7.62 48.26,7.62 48.26,10.16 47.5,10.92 47.5,13.21 47.75,13.46 47.75,29.97 47.36,30.36 IC3.10 | v35.56,6.1 35.56,5.08 35.31,4.83
  Top 0.406: v65.53,24.64 65.53,24.89 65.28,25.15 | IC4.4 84.45,52.2 84.31,52.05 83.82,51.56 | 42.89,43.39 42.42,43.94 v42.55,44.07 | 50.5,46.02 v51.31,45.72 | 42.16,33.53 42.16,33.78 v42.67,34.29 | v34.54,31.24 33.78,30.48 | ICSP.2 58.02,26.3 v57.15,27.18 | R25.2 30.73,52.32 v31.5,53.09 | IC1.2 15.41,13.89 v13.37,11.72 | v43.18,40.64 43.18,40.89 42.93,41.15 42.93,40.89 v43.18,40.64
  Top 0.508: 84.45,51.91 84.31,52.05 | 84.45,53.08 IC4.4 84.45,53.08
  Top 0.61: v30.23,54.36 30.99,54.36 31.24,54.1 31.24,52.67 R25.2
  Bottom 0.254: v62.48,47.5 62.48,47.75 65.53,50.8 65.53,51.31 64.26,52.58 64.26,53.09 66.67,54.99 66.67,57.02 v62.48,60.96 | v38.61,7.37 36.83,7.37 v35.56,6.1 | v30.86,45.09 30.86,44.83 31.5,44.2 | 31.5,42.93 31.75,42.67 | 31.81,42.67 31.75,42.67 | 31.75,42.67 31.43,42.86
  Bottom 0.406: ICSP.2 59.31,25.27 62.23,22.35 63.25,22.35 v65.53,24.64 | v42.55,44.07 33.27,44.2 31.75,42.67 33.78,40.64 v43.18,40.64 43.43,40.39 45.97,40.39 47.5,41.91 49.28,41.91 51.31,43.94 v51.31,45.72 | BLUETOOTH_J6.2 58.17,65.28 v62.48,60.96 | v34.54,31.24 37.59,34.29 v42.67,34.29 40.64,32.26 40.64,31.5 44.96,27.18 v57.15,27.18 | v31.5,53.09 32,53.09 32.51,52.58 32.51,45.21 31.5,44.2 31.5,42.93 | v13.37,11.72 13.5,3.47 14.02,2.79 15.71,2.79 POWER.5
  Bottom 0.61: J1.6 6.95,67.98 20.57,54.36 v30.23,54.36
  pour Top: -0.76,40.13 28.7,40.13 28.7,56.39 55.12,56.39 55.12,79.25 101.09,79.25 101.09,-1.02 -0.76,-1.02
ADC0
  Top 0.254: R10.2 32.51,67.4 R2.2 | C7.1 R10.2 | IC3.97 38,34.89 32.77,40.13 32.77,64.01 32.26,64.52 32.26,66.38 R10.2
ADC1
  Top 0.254: R3.2 35.05,69.76 C8.1 | IC3.96 38.27,35.39 33.27,40.39 33.27,64.26 32.77,64.77 32.77,66.89 R11.2
  Top 0.406: R11.2 C8.1
ADC2
  Top 0.254: IC3.95 38.53,35.89 33.78,40.64 33.78,49.02 38.61,53.85 38.48,66.38 C9.1
  Top 0.406: R4.2 36.32,69.76 R12.2 C9.1
ADC3
  Top 0.254: R5.2 38.61,68.67 R13.2 | R13.2 C10.1 | IC3.94 38.79,36.39 34.29,40.89 34.29,48.77 39.12,53.59 38.99,66.38 R13.2
ADC4
  Top 0.254: R6.2 44.7,67.91 C11.1 | R14.2 C11.1 | IC3.93 39.05,36.89 34.8,41.15 34.8,48.51 42.16,55.88 44.2,55.88 44.96,56.64 44.83,66.51 C11.1
ADC5
  Top 0.254: R7.2 46.74,67.91 | 46.74,67.91 R15.2 45.34,66.51 45.47,56.39 44.45,55.37 42.42,55.37 35.31,48.26 35.31,41.4 39.31,37.39 IC3.92 | C12.1 47.24,67.4 46.74,67.91
ADC6
  Top 0.254: R8.2 48.77,67.65 R16.2 C13.1 51.05,66.64 51.05,60.2 45.72,54.86 42.67,54.86 35.81,48.01 35.81,41.66 39.58,37.89 IC3.91
ADC7
  Top 0.254: R9.2 50.8,68.92 R17.2 | R17.2 C14.1 | R17.2 51.9,67.4 | IC3.90 39.84,38.39 36.58,41.66 36.58,47.75 42.93,54.1 45.72,54.1 51.56,59.94 51.56,66.64 R17.2
AGND  (via drill 0.6)
  Top 0.254: v18.29,38.35 19.3,37.34 U$2.2 19.72,34.63 21.08,33.27 38.35,33.27 38.86,33.91 40.5,33.91 IC3.99 | v12.19,47.24 12.45,47.24 13.21,46.48 14.14,46.48 IC2.25 | 33.02,6.62 34.05,6.62 36.07,8.64 36.07,14.99 28.19,22.86 28.19,26.92 v23.88,31.24 | C5.2 31.72,3.85 C6.2
  Top 0.305: 33.02,6.62 C4.2 31.66,3.91 C6.2
  Bottom 0.254: v12.19,47.24 12.45,46.99 12.45,45.47 13.97,43.94 14.48,43.94 16.26,42.16 16.26,40.39 v18.29,38.35 23.88,32.77 v23.88,31.24
AREF  (via drill 0.6)
  Top 0.254: IC3.98 38.46,34.39 38.1,34.04 v26.16,34.29 | v25.65,31.24 29.72,27.18 29.72,23.11 37.34,15.49 37.34,3.3 38.86,1.78 82.55,1.78 83.57,3.05 83.57,5.26 JP6.3
  Bottom 0.254: v26.16,34.29 25.4,33.27 25.4,31.5 v25.65,31.24
FTDI_3.3V
  Top 0.406: C17.1 14.39,54.7 | R21.2 18.71,55.03 17.02,53.34 | IC2.17 15.37,51.69
  Top 0.61: J10.2 9.4,55.12 C17.1 15.66,53.34 17.02,53.34 15.37,51.69
FTDI_CBUS0
  Top 0.406: IC2.23 15.96,47.79 16.51,47.24 16.51,43.01 R20.2
FTDI_CBUS1
  Top 0.406: IC2.22 16.33,48.44 18.29,46.48 18.29,41.4 18.03,41.15 R24.2
FTDI_CBUS2
  Top 0.406: IC2.13 23.3,52.34 R19.2
GND  (via drill 0.6)
  Top 0.254: C7.2 R10.1 | R11.1 C8.2 R12.1 | R13.1 C10.2 R14.1 C11.2 | C9.2 R12.1 | R12.1 v36.32,64.26 | C12.2 R16.1 C13.2 | C12.2 v47.5,64.26 | R15.1 C12.2 | U$2.1 21.42,39.54 v21.34,39.62 | IC3.11 47.86,32.62 v48.26,33.02 | IC3.32 55.05,36.39 v54.86,36.58 | ON.C 63.68,69.01 62.48,67.82 BLUETOOTH_J6.3 | IC6.13 84.45,32.13 v84.58,32 | R34.2 82.38,38.01 v82.04,38.35 | IC3.81 42.32,42.89 42.32,42.83 42.61,42.55 | 49.36,45.89 IC3.62
  Top 0.305: C1.2 9.37,8.6 v8.89,8.38 | PC2.- 31.53,9.37 | Y1.2 18.78,25.92 v18.03,26.67
  Top 0.406: C16.2 5.59,34.46 | 5.59,34.46 C15.2 | R30.1 3.3,35.31 4.32,34.29 5.42,34.29 | 5.42,34.29 5.59,34.46 | 5.42,34.29 5.42,33.87 v4.32,32.77 | C17.2 16.09,56.55 v15.75,56.9 | IC2.18 11.43,51.04 v11.18,51.05 | IC2.21 11.25,49.09 v10.67,48.51 10.67,46.48 11.31,45.84 IC2.26 | IC2.7 19.38,48.44 v19.3,48.51 | R19.1 v27.69,53.09 26.16,51.56 R18.1 | R24.1 R20.1 v13.72,42.67 | IC1.1 17.73,12.76 v18.29,12.19 | R32.2 76.8,58.08 v76.71,58.17 | IC4.13 84.45,60.58 v83.31,61.72 | 49.36,45.89 v49.78,45.34 | v55.12,40.39 55.12,39.88 v53.59,38.35 | 42.61,42.55 42.67,41.91 42.16,41.4 42.16,38.35 v42.67,37.85 | SW1.P$2 v25.4,21.34
  Top 0.61: PC2.- 31.53,7.4 v31.5,7.37 | PC1.- 24.41,8.1 v24.64,7.11 | C2.2 17.02,14.9 IC1.1
  Bottom 0.254: v21.34,39.62 21.34,40.39 21.08,40.64 | v48.26,33.02 48.26,33.53 | v54.86,36.58 54.36,36.58 | v84.58,32 85.09,32 | v82.04,38.35 82.04,38.61 81.79,38.86
  Bottom 0.305: v8.89,8.38 8.64,8.13 | v18.03,26.67 18.03,27.43
  Bottom 0.406: v18.29,12.19 18.29,11.94 18.54,11.68 | v76.71,58.17 76.71,58.67 | v83.31,61.72 83.31,61.98 83.06,62.23 | v49.78,45.34 49.78,46.48 50.55,47.24 52.32,47.24 52.58,46.99 52.58,44.7 52.32,44.45 52.32,43.18 v55.12,40.39 | v53.59,38.35 53.59,37.85 54.1,37.34 | v42.67,37.85 43.18,37.85 | v25.4,21.34 25.46,21.34 25.65,21.14
  Bottom 0.61: v31.5,7.37 30.99,6.86
  other vias: 52.7,61.72 49.59,61.66 46.8,61.66 43.81,61.66 40.26,61.66 37.53,61.59 34.42,61.59 35.5,52.32 34.29,52.32 36,61.59
  pour Bottom (isolate 0.254, rank 2): -0.76,79.25 100.84,79.25 100.84,-0.76 -0.76,-0.76
  pour Top (rank 2): 28.7,78.36 28.7,50.8 54.36,50.8 54.29,78.36
  pour Top: 38.16,59.56 38.29,59.56 38.29,53.47 38.29,53.4 34.29,49.4 33.78,49.4 33.4,49.78 33.4,60.45 33.59,60.64 37.4,60.64 38.35,59.69
N$1
  Top 0.254: R2.1 32.51,74.03 J3.1
N$3
  Top 0.254: R28.2 61.89,71.12 ON.A
N$4  (via drill 0.6)
  Top 0.406: IC2.19 16.92,50.39 v17.53,49.78 | v18.8,39.62 R23.1 R22.2
  Bottom 0.406: v17.53,49.78 18.03,49.28 18.03,44.45 19.05,43.43 19.05,39.88 v18.8,39.62
N$5
  Top 0.254: R6.1 44.7,74.03 J4.1
N$6
  Top 0.254: R3.1 34.54,74.06 J3.2
N$7
  Top 0.61: J1.5 4.99,65.44 5.84,66.29 J8.2
N$8
  Top 0.254: R4.1 J3.3
N$9  (via drill 0.6)
  Top 0.406: J1.3 8.48,60.36 v9.91,58.93 | v23.11,49.28 J7.2
  Bottom 0.406: v9.91,58.93 15.75,53.09 19.3,53.09 v23.11,49.28
N$10
  Top 0.254: R5.1 38.61,74.06 J3.4
N$11  (via drill 0.6)
  Top 0.406: J1.2 7.71,57.82 v8.38,57.15 | v23.37,47.75 25.15,46.48 J6.2
  Bottom 0.406: v8.38,57.15 14.22,51.31 18.54,51.31 v23.37,47.75
N$12
  Top 0.254: R7.1 46.74,74.06 J4.2
N$13
  Top 0.254: R8.1 J4.3
N$14
  Top 0.254: R9.1 50.8,74.06 J4.4
N$15
  Top 0.406: D2.C 1.41,36.35 R30.2
N$17
  Top 0.406: IC4.15 81.92,58.04 81.28,57.4 80.26,57.4 79.76,57.91 79.76,58.51 R32.1 78.49,61.81 R31.2
N$18
  Top 0.406: IC6.15 81.92,35.6 R34.1 79.76,35.9 R33.2
PA0  (via drill 0.6)
  Top 0.254: IC3.78 39.43,44.39 v37.85,45.97
  Bottom 0.254: v37.85,45.97 37.85,51.82 31.75,57.91 25.65,57.91 23.37,60.2 20.7,60.2 J2.2
PA1  (via drill 0.6)
  Top 0.254: IC3.77 39.94,44.89 38.86,45.97 38.86,49.02 42.93,53.09 45.97,53.09 53.85,60.96 v53.85,62.99
  Bottom 0.254: v53.85,62.99 53.85,72.9 55.37,74.42 55.88,74.42 BLUETOOTH_J6.6
PA2
  Top 0.254: IC3.76 40.2,45.39 39.62,45.97 39.62,48.77 43.18,52.32 46.48,52.32 BLUETOOTH_J6.1
PA3  (via drill 0.6)
  Top 0.254: IC3.75 42.86,49.47 43.94,50.55 v49.28,50.55 | v62.17,50.42 64.64,53.09 v67.94,53.15 | v70.1,55.37 70.1,55.63 72.14,57.66 75.44,57.66 76.45,56.64 81.53,56.64 83.31,54.86 83.31,53.19 IC4.3 83.19,51.44 80.77,49.02 80.77,38.61 79.5,37.34 78.49,37.34 77.98,36.83 77.98,31.24 78.74,30.48 82.55,30.48 83.06,29.97 83.06,28.3 IC6.3
  Bottom 0.254: v49.28,50.55 v62.17,50.42 | v67.94,53.15 v70.1,55.37
PA4  (via drill 0.6)
  Top 0.254: IC3.74 43.36,49.2 44.2,50.04 46.48,50.04 v46.99,49.53 | v64.01,50.8 65.28,52.07 v69.09,52.07 | v76.2,53.09 76.2,53.34 77.72,54.86 81.53,54.86 81.79,54.61 81.79,53.19 IC4.2 81.92,51.69 81.28,51.05 78.99,51.05 77.47,49.53 77.47,30.73 78.49,29.72 81.79,29.72 82.04,29.46 82.04,28.3 IC6.2
  Bottom 0.254: v46.99,49.53 62.74,49.53 v64.01,50.8 | v69.09,52.07 70.61,52.07 71.37,52.83 75.95,52.83 v76.2,53.09
PA5  (via drill 0.6)
  Top 0.254: IC3.73 43.86,48.43 v44.45,49.02 | v60.83,48.51 63.5,48.51 65.79,50.8 68.83,50.8 v69.09,50.55 | v76.96,51.31 76.96,52.07 78.49,53.59 80.11,53.59 IC4.1 | v76.45,47.5 76.45,29.21 77.72,27.94 80.42,27.94 IC6.1
  Bottom 0.254: v44.45,49.02 45.97,49.02 46.48,48.51 v60.83,48.51 | v69.09,50.55 69.34,50.29 75.95,50.29 | 75.95,50.29 v76.96,51.31 | 75.95,50.29 75.95,48.01 v76.45,47.5
PA6  (via drill 0.6)
  Top 0.254: IC3.72 44.36,46.39 v44.01,45.78 | v44.2,42.16 44.2,37.34 46.61,35.56 v49.53,36.07 | v62.48,25.91 68.58,19.81 68.58,15.24 70.61,13.21 80.01,13.21 84.33,8.89 86.36,8.89 IC5.2
  Bottom 0.254: v44.01,45.78 43.94,42.42 v44.2,42.16 | v49.53,36.07 52.58,35.81 v62.48,25.91
PA7  (via drill 0.6)
  Top 0.254: IC5.3 90.42,10.67 88.39,8.64 86.87,8.64 86.61,8.38 84.07,8.38 79.76,12.7 70.36,12.7 68.07,14.99 68.07,19.56 66.29,21.34 65.28,21.34 v62.74,23.88 | v47.24,36.58 45.97,36.58 44.96,37.59 44.96,41.15 v45.72,41.91 | v45.09,44.9 44.96,46.1 44.83,47.3 IC3.71
  Bottom 0.254: v62.74,23.88 62.17,24.45 52.32,35.05 48.77,35.05 v47.24,36.58 | v45.72,41.91 45.72,42.42 44.7,43.43 44.7,44.45 v45.09,44.9
PB0
  Top 0.254: IC3.19 51.86,25.99 JP2.1
PB1
  Top 0.254: ICSP.3 55.24,22.73 53.78,24.19 53.78,28.83 52.26,30.35 52.32,31.36 IC3.20
PB2
  Top 0.254: ICSP.4 57.78,22.73 56.64,23.88 54.86,23.88 54.29,24.45 54.29,28.96 52.77,30.42 52.83,31.36 IC3.21
PB3
  Top 0.254: ICSP.1 55.48,28.84 55.12,29.21 54.67,29.21 53.34,30.48 53.34,31.37 IC3.22
PB4
  Top 0.254: JP6.8 70.75,6.98 59.69,18.03 59.69,26.67 56.64,29.72 54.61,29.84 53.85,30.61 53.85,31.38 IC3.23
PB5
  Top 0.254: JP6.7 73.11,5.38 60.2,18.29 60.2,26.92 56.77,30.23 54.8,30.23 54.42,30.61 IC3.24
PB6
  Top 0.254: IC3.25 57,31.39 60.71,27.69 60.71,18.54 70.87,8.38 72.82,8.38 JP6.6
PB7  (via drill 0.6)
  Top 0.254: JP6.5 78.19,5.38 74.68,8.89 71.12,8.89 61.21,18.8 61.21,29.46 v60.45,30.23 | v59.44,34.04 58.42,34.04 57.66,33.27 56.98,33.27 IC3.26
  Bottom 0.254: v60.45,30.23 60.45,33.02 v59.44,34.04
PC0
  Top 0.254: JP1.10 71.63,58.42 67.31,58.42 58.93,50.04 55.37,50.04 53.85,48.51 53.85,47.41 IC3.53
PC1
  Top 0.254: JP1.9 72.14,60.71 70.61,59.18 67.06,59.18 58.67,50.8 55.12,50.8 53.34,49.02 53.34,47.42 IC3.54
PC2
  Top 0.254: JP1.8 74.68,63.75 73.66,62.74 71.63,62.74 68.58,59.69 66.8,59.69 58.42,51.31 54.86,51.31 52.9,49.28 52.9,47.42 IC3.55
PC3
  Top 0.254: JP1.7 68.33,60.2 66.55,60.2 58.17,51.82 54.61,51.82 52.32,49.53 52.32,47.43 IC3.56
PC4
  Top 0.254: JP1.6 74.42,66.55 73.15,65.28 70.87,65.28 57.91,52.32 54.36,52.32 51.82,49.78 51.82,47.44 IC3.57
PC5
  Top 0.254: JP1.5 71.37,66.55 57.66,52.83 54.1,52.83 51.37,50.04 51.37,47.45 IC3.58
PC6
  Top 0.254: JP1.4 73.41,67.82 71.69,67.75 70.42,66.48 70.36,66.29 57.4,53.34 53.85,53.34 50.86,50.29 50.86,47.46 IC3.59
PC7
  Top 0.254: JP1.3 71.82,68.9 57.15,53.85 53.59,53.85 50.35,50.55 50.35,47.46 IC3.60
PD7  (via drill 0.6)
  Top 0.254: v67.82,49.53 67.82,47.5 66.55,46.04 57.7,46.04 IC3.50 | JP3.14 71.88,54.36 v71.88,55.88
  Bottom 0.254: v71.88,55.88 71.37,55.88 70.87,56.39 69.6,56.39 66.8,53.59 66.8,52.83 67.82,51.82 v67.82,49.53
PE0  (via drill 0.6)
  Top 0.254: PWML.1 39.34,10.89 42.16,13.72 42.16,28.19 43.43,29.46 43.43,31.32 IC3.2 43.43,31.47 43.43,32.77 44.45,33.78 v44.7,33.78 | IC2.1 22,44.54 v31.24,35.31
  Bottom 0.254: v31.24,35.31 43.18,35.31 v44.7,33.78
PE1  (via drill 0.6)
  Top 0.254: PWML.2 41.88,10.13 43.94,12.19 43.94,31.31 IC3.3 43.94,31.47 43.94,32.51 44.2,32.77 45.97,32.77 46.48,33.27 v46.48,33.78 | IC2.5 22.45,47.14 v33.02,36.58
  Bottom 0.254: v33.02,36.58 43.69,36.58 v46.48,33.78
PE3  (via drill 0.6)
  Top 0.254: v44.96,20.57 44.83,31.3 IC3.5 | v49.78,14.61 52.04,12.35 PWML.6
  Bottom 0.254: v49.78,14.61 45.21,19.18 45.21,20.32 v44.96,20.57
PE4
  Top 0.254: PWML.3 44.42,10.38 45.97,11.94 45.97,28.96 45.34,29.46 45.34,31.29 IC3.6
PE5
  Top 0.254: PWML.4 46.96,28.99 45.85,29.97 45.85,31.28 IC3.7
PG0
  Top 0.254: IC3.51 54.86,48 55.88,49.02 59.44,49.02 64.52,54.1 68.58,54.1 70.87,51.82 70.87,51.05 71.63,50.29 73.41,50.29 JP3.11
PG1
  Top 0.254: IC3.52 54.36,48.27 55.63,49.53 59.18,49.53 64.26,54.61 69.09,54.61 JP3.12
PG2  (via drill 0.6)
  Top 0.254: v74.23,56.52 74.68,56.07 JP3.13 | v70.23,57.47 67.63,57.47 v65.72,55.56 | v46.35,44.26 46.35,45.34 45.4,46.29 45.4,47.35 IC3.70
  Bottom 0.254: v74.23,56.52 74.23,56.9 73.47,57.66 70.42,57.66 v70.23,57.47 | v65.72,55.56 65.72,55.37 61.59,51.24 46.93,51.5 45.66,49.97 43.24,49.97 42.42,49.15 42.42,47.69 42.35,47.62 42.35,47.43 42.48,47.31 45.15,47.31 46.55,45.91 46.55,44.45 v46.35,44.26
PG5  (via drill 0.6)
  Top 0.254: PWML.5 49.5,11.72 v48.51,12.7 | v40.64,20.57 40.64,29.17 IC3.1
  Bottom 0.254: v48.51,12.7 v40.64,20.57
PH3
  Top 0.254: PWML.7 54.58,12.73 49.86,17.45 IC3.15 49.85,31.32
PH4
  Top 0.254: PWML.8 57.12,12.48 50.35,19.24 50.35,31.32 IC3.16
PH5
  Top 0.254: JP6.10 63.97,5.38 58.93,10.41 58.67,12.19 50.86,20 50.86,31.33 IC3.17
PH6
  Top 0.254: JP6.9 68.21,5.45 63.75,9.91 62.36,9.78 51.36,20.77 IC3.18 51.37,31.34 51.37,30.54
PL0
  Top 0.254: IC3.35 65.07,37.89 67.31,40.13 73.41,40.13 JP3.3
PL1
  Top 0.254: IC3.36 64.81,38.39 67.82,41.4 JP3.4
PL2
  Top 0.254: IC3.37 64.55,38.89 68.33,42.67 73.41,42.67 JP3.5
PL3
  Top 0.254: IC3.38 64.29,39.39 68.83,43.94 JP3.6
PL4
  Top 0.254: IC3.39 64.02,39.89 69.34,45.21 73.41,45.21 JP3.7
PL5
  Top 0.254: IC3.40 63.76,40.39 69.85,46.48 JP3.8
PL6
  Top 0.254: IC3.41 63.5,40.89 70.36,47.75 73.41,47.75 JP3.9
PL7
  Top 0.254: IC3.42 63.24,41.39 70.87,49.02 JP3.10
POWER_EN
  Top 0.406: R21.1 20.41,55.03 21.34,54.1 21.34,53.06 IC2.14
PWRIN
  Top 1.27: X1.2 12.68,25.16 14.99,22.86 14.99,20.83 10.41,16.26 7.44,16.26 D1.A
RESET  (via drill 0.6)
  Top 0.254: v19.81,32.51 40.13,32.51 | 40.13,32.51 42.16,32.51 44.7,35.05 55.37,35.05 55.69,35.37 56.84,35.37 IC3.30 | 75.16,21.86 v75.18,21.84 | v75.18,17.02 75.18,15.22 | ICSP.5 55.48,19.95 56.9,18.54 v58.67,18.54 | v39.88,29.97 39.88,32.26 40.13,32.51
  Top 0.305: POWER.3 12.23,7.16 R27.1 | D3.A 19.11,8.83 17.02,10.92 14.4,10.92 | 14.4,10.92 C1.1 | 14.4,10.92 14.4,11.6 14.48,11.68 16.26,11.68 v16.51,11.94 | v19.81,32.51 19.56,33.44 R22.1
  Top 0.406: SW1.P$1 23.52,17.62 21.46,19.68 v21.46,21.46
  Top 0.61: C1.1 12.08,7.17 R27.1
  Bottom 0.254: v75.18,21.84 v75.18,17.02 73.66,18.54 v58.67,18.54 | ICSP.5 49.66,20.19 v39.88,29.97
  Bottom 0.305: v16.51,11.94 16.51,19.81 19.81,23.11 v19.81,32.51
  Bottom 0.406: v21.46,21.46 19.81,23.11
RXD1  (via drill 0.6)
  Top 0.254: IC3.45 44.99,42.89 41.91,45.97 40.39,45.97 40.13,46.23 40.13,48.51 43.43,51.82 46.74,51.82 55.88,60.96 57.91,60.96 59.94,62.99 v59.94,66.8
  Bottom 0.254: v59.94,66.8 59.94,68.07 58.42,69.6 57.66,69.6 BLUETOOTH_J6.4
RXD2  (via drill 0.6)
  Top 0.254: IC5.1 85.09,10.67 RXD2_JUMPER.1 90.93,13.21 91.95,12.19 91.95,5.08 v90.42,3.56 | v79.25,2.79 63.25,2.79 58.67,7.37 51.82,7.37 50.8,8.38 50.8,11.94 48.36,14.38 IC3.12 48.39,31.29
  Bottom 0.254: v90.42,3.56 88.14,3.56 86.11,1.52 80.52,1.52 v79.25,2.79
RXD2_OUT  (via drill 0.6)
  Top 0.254: J13.2 88.39,20.57 IC5.6 | RXD2_JUMPER.2 88.65,15.75 v88.9,16
  Bottom 0.254: v88.9,16 88.9,16.51 IC5.6
RXD3  (via drill 0.6)
  Top 0.254: J9.1 82.55,22.86 80.52,24.89 77.22,24.89 70.87,31.24 v70.87,32.26 | v63.75,44.2 v60.96,44.2 | v53.59,44.96 53.09,44.96 52.58,44.45 48.01,44.45 47.75,44.7 47.75,44.96 48.83,45.97 48.83,47.3 IC3.63
  Bottom 0.254: v70.87,32.26 70.61,32.26 65.53,37.34 65.53,42.42 v63.75,44.2 | v60.96,44.2 54.86,44.2 v53.59,44.96
SCL  (via drill 0.6)
  Top 0.254: R26.1 29.46,45.85 29.46,41.15 v32.77,38.1 | v51.05,39.37 51.56,39.37 53.59,41.4 55.37,41.4 55.88,41.91 56.85,41.91 IC3.43 56.88,41.91 58.17,41.91 58.42,42.16 58.42,42.42 58.93,42.93 v59.69,42.93 | JP6.1 88.53,5.45 86.61,7.37 84.33,7.37 83.82,7.87 78.23,7.87 77.47,8.64 77.47,10.67 v78.23,11.43 | v78.49,14.48 78.49,16.26 75.18,19.56 74.42,19.56 v72.64,21.34
  Top 0.406: J6.1 30.65,46.74 R26.1
  Bottom 0.254: v32.77,38.1 39.37,38.35 39.62,38.61 40.89,38.61 41.15,38.86 50.55,38.86 v51.05,39.37 | v78.23,11.43 78.23,14.22 v78.49,14.48 | v72.64,21.34 72.39,21.34 62.74,30.99 62.74,32.77 59.94,35.56 59.94,42.67 v59.69,42.93
SDA  (via drill 0.6)
  Top 0.254: R25.1 31.58,49.95 32.26,49.28 32.26,44.45 30.73,42.93 30.73,42.16 v31.56,41.34 | v51.82,41.91 56.84,42.42 IC3.44 | JP6.2 85.56,5.38 83.57,7.37 77.22,7.37 76.2,8.38 v76.2,11.68 | v76.71,14.22 76.71,17.27 75.44,18.54 73.15,18.54 v70.36,21.34
  Top 0.406: J7.1 30.06,49.28 R25.1
  Bottom 0.254: v31.56,41.34 33.53,39.37 48.77,39.37 v51.82,41.91 58.67,35.05 59.69,35.05 62.23,32.51 62.23,30.73 70.36,22.61 v70.36,21.34 | v76.2,11.68 76.2,13.72 v76.71,14.22
SLEEP
  Top 0.406: IC2.12 23.91,51.69 R18.2
TXD1  (via drill 0.6)
  Top 0.254: IC3.46 45.19,43.33 42.1,46.42 40.89,46.48 40.64,46.74 40.64,48.26 43.69,51.31 46.99,51.31 56.13,60.45 58.17,60.45 60.45,62.74 60.45,64.77 v62.23,66.55
  Bottom 0.254: v62.23,66.55 62.23,68.58 58.67,72.14 57.66,72.14 BLUETOOTH_J6.5
TXD2  (via drill 0.6)
  Top 0.254: TXD2_JUMPER.1 94.49,10.67 IC5.4 93.22,4.32 90.42,2.54 v84.84,2.54 | v81.53,3.05 80.77,3.81 63.75,3.81 59.69,7.87 54.1,7.87 53.59,8.38 53.59,12.95 49.28,17.27 49.28,29.97 48.9,30.48 48.9,31.3 IC3.13
  Bottom 0.254: v84.84,2.54 82.8,2.79 v81.53,3.05
TXD2_OUT
  Top 0.254: J13.1 85.85,20.57 IC5.7 88.14,18.03 90.68,15.49 TXD2_JUMPER.2
TXD3  (via drill 0.6)
  Top 0.254: J9.2 78.23,22.86 v69.34,31.75 | v59.56,46.99 57.15,46.99 55.12,44.96 55.12,44.45 54.61,43.94 47.75,43.94 47.24,44.45 47.24,45.47 47.75,45.97 48.26,46.23 48.32,46.28 IC3.64
  Bottom 0.254: v69.34,31.75 69.34,32.51 64.77,37.08 64.77,41.91 v59.56,46.99
USB_GND
  Top 0.406: J5.GND 5.29,42.42 6.6,42.42 7.28,43.09 C19.2 C18.2
USBDN
  Top 0.406: J5.D- 6.24,44.34 7.87,45.97 7.87,51.82 8.38,52.32 14.14,52.32 IC2.16
USBDP  (via drill 0.6)
  Top 0.406: J5.D+ 6.6,43.69 8.64,45.72 8.64,50.8 v8.89,51.31 | v9.91,53.34 13.81,53.34 IC2.15
  Bottom 0.406: v8.89,51.31 v9.91,53.34
V_USB  (via drill 0.6)
  Top 0.254: J5.VBUS 5.81,44.99 | 6.16,45.78 v6.6,46.23
  Top 0.305: 6.16,45.78 6.16,45.34 5.81,44.99
  Top 0.406: IC2.4 19.29,46.49 16,49.78 14.2,49.78 IC2.20 10.37,49.74 9.65,49.02 9.65,45.55 C19.1 C18.1 | C15.1 C16.1 4.32,36.92 4.32,37.34 | 4.32,37.34 7.11,40.13 J11.2 10.67,39.62 R23.2 | 4.32,37.34 D2.A
  Top 0.61: v8.64,44.2 9.82,44.2 C19.1
  Bottom 0.61: v6.6,46.23 v8.64,44.2 8.64,42.16 10.16,40.64 J11.2
VID_0
  Top 0.254: IC4.5 85.72,48.9 89.92,44.7 89.92,40.64 90.68,39.88 90.68,37.34 VIDEO_IN.1 93.22,33.27 91.19,31.24 87.63,31.24 85.72,29.34 IC6.5
VID_1
  Top 0.254: IC4.6 87,48.39 90.42,44.96 90.42,40.89 91.19,40.13 91.19,39.37 VIDEO_IN.2 94.74,35.81 94.74,33.02 92.46,30.73 88.9,30.73 87,28.83 IC6.6
VID_2  (via drill 0.6)
  Top 0.254: IC4.7 88.27,50.42 87.63,49.78 87.63,48.51 89.41,46.74 v89.92,46.74 | IC6.7 88.27,29.34 88.9,29.97 92.71,29.97 95.25,32.51 95.25,37.85 VIDEO_IN.3
  Bottom 0.254: v89.92,46.74 90.17,46.74 91.44,45.47 91.44,41.66 VIDEO_IN.3
VID_3  (via drill 0.6)
  Top 0.254: IC4.8 89.53,51.18 v89.92,50.8 | IC6.8 92.94,28.17 98.55,33.78 98.55,43.43 v98.3,43.69
  Bottom 0.254: v89.92,50.8 91.95,48.77 94.49,48.77 95,48.26 95,44.2 94.87,44.07 | 94.87,44.07 VIDEO_IN.4 | v98.3,43.69 95.25,43.69 94.87,44.07
VID_4  (via drill 0.6)
  Top 0.254: IC4.9 89.53,59.05 95,53.59 95,46.74 VIDEO_IN.5 95,43.18 v95,41.15 | IC6.9 89.53,35.18 v90.42,36.07
  Bottom 0.254: v90.42,36.07 90.42,36.83 92.2,38.61 94.49,38.61 95,39.12 v95,41.15
VID_5  (via drill 0.6)
  Top 0.254: IC4.10 88.27,57.78 91.19,54.86 91.19,49.53 VIDEO_IN.6 | IC6.10 88.27,35.94 v88.9,36.58
  Bottom 0.254: v88.9,36.58 91.19,38.86 91.19,40.39 90.68,40.89 90.68,44.45 88.65,46.48 88.65,46.99 89.15,47.5 89.41,47.5 89.66,47.75 92.96,47.75 VIDEO_IN.6
VID_6  (via drill 0.6)
  Top 0.254: IC4.11 87,57.53 v88.39,56.13 | IC6.11 87,38.99 89.41,41.4 89.41,44.2 v85.15,47.94
  Bottom 0.254: v88.39,56.13 92.71,56.13 95,53.85 95,51.82 VIDEO_IN.7 91.44,51.82 89.15,51.82 88.14,50.8 86.36,50.8 85.34,49.78 v85.15,47.94
VID_7  (via drill 0.6)
  Top 0.254: IC4.12 85.72,57.28 v86.11,56.9 | IC6.12 85.72,38.48 88.9,41.66 88.9,43.43 84.07,47.12 84.07,50.04 v84.84,50.8
  Bottom 0.254: v86.11,56.9 88.14,54.86 91.95,54.86 93.22,53.59 VIDEO_IN.8 88.9,52.58 87.88,51.56 86.11,51.56 85.34,50.8 v84.84,50.8
VIDEO_OUT
  Top 0.406: IC4.16 80.64,61.68 R31.1 80.35,62.06 85.6,67.31 VIDEO_OUT.1
VIDEO_OUT1  (via drill 0.6)
  Top 0.406: R33.1 80.53,34.2 IC6.16 80.77,34.19 80.77,32 81.03,31.75 v81.79,31.75 | VIDEO_OUT2.1 84.07,40.64 v83.57,40.13
  Bottom 0.406: v83.57,40.13 83.57,33.53 v81.79,31.75
VIN
  Top 0.61: IC1.3 13.1,15.85 C2.1 15.24,18.54 16.26,19.56 19.4,19.56 PC1.+ 27.43,11.53 27.43,6.6 25.23,4.4 POWER.8
  Top 1.27: D1.C 9.12,10.21 IC1.3
XTAL1  (via drill 0.6)
  Top 0.254: R1.1 26.84,25.07 v26.85,25.27 | v30.99,25.4 v39.62,25.4 | v57.91,15.49 v60.96,15.49 | v65.28,16.26 65.28,18.16 v66.48,19.56 | v68.33,21.34 68.33,30.73 v67.06,32 | v63.25,36.83 62.74,37.34 56.85,37.4 IC3.34
  Top 0.305: Y1.3 22.35,24.92 R1.1
  Bottom 0.254: v26.85,25.27 30.73,25.15 v30.99,25.4 | v39.62,25.4 41.91,25.4 51.56,15.75 57.66,15.75 v57.91,15.49 | v60.96,15.49 64.52,15.49 v65.28,16.26 | v66.48,19.56 v68.33,21.34 | v67.06,32 67.06,33.02 v63.25,36.83
XTAL2  (via drill 0.6)
  Top 0.254: R1.2 26.34,26.84 v26.42,26.92 | v30.99,26.92 v39.62,26.92 | v57.15,16.76 v59.69,16.76 | v64.01,17.27 64.01,19.05 v65.28,20.32 | v67.06,23.62 67.06,30.23 v65.53,31.75 | v61.72,36.07 60.96,36.83 IC3.33
  Top 0.305: Y1.1 22.42,26.92 R1.2
  Bottom 0.254: v26.42,26.92 v30.99,26.92 | v39.62,26.92 41.66,26.92 51.82,16.76 v57.15,16.76 | v59.69,16.76 63.5,16.76 v64.01,17.27 | v65.28,20.32 67.31,22.35 67.31,23.37 v67.06,23.62 | v65.53,31.75 65.53,32.26 v61.72,36.07

### Text on the board
Top: 5V | 3V3
tPlace: 30 | 31 | 32 | 33 | 34 | 35 | 36 | 37 | 39 | V7 | GND | 38 | 40 | 41 | 43 | 42 | 44 | 45 | 47 | 46 | 48 | 49 | V0 | 50 | 53 | 52 | 51 | TM | 0 | 1 | 2 | 3 | 4 | 5 | 6 | 7 | 20 | 21 | 8 | 9 | 10 | 11 | 12 | 13 | 14 | AREF
tNames: UROV Motherboard / V1.0 | PA1 | Sam Romano | TX1 | 5V | 5V | RX1 | 5V | PA2 | ANALOG IN | PA0 | SDA | MADE IN | ITALY | PWM | GND | . | TX3 | RX3 | RESET | Max Walker | RX | TX | RX2 | TX2 | Andrew Hostler | GND | 3V | GND | VIN | 5V | RST | 5V
bNames: MADE IN | ITALY
ReferenceLC: PC1 | PC2
ReferenceLS: Tether | OUT | Accelerometer | Video | USB | Regulator | IN | Barrel Jack | ESC Signals
200bmp: /Users/dudeman444/Downloads/seahorseBW.bmp